# EAGLE design hiiri627v07 (EAGLE 7.5.0)
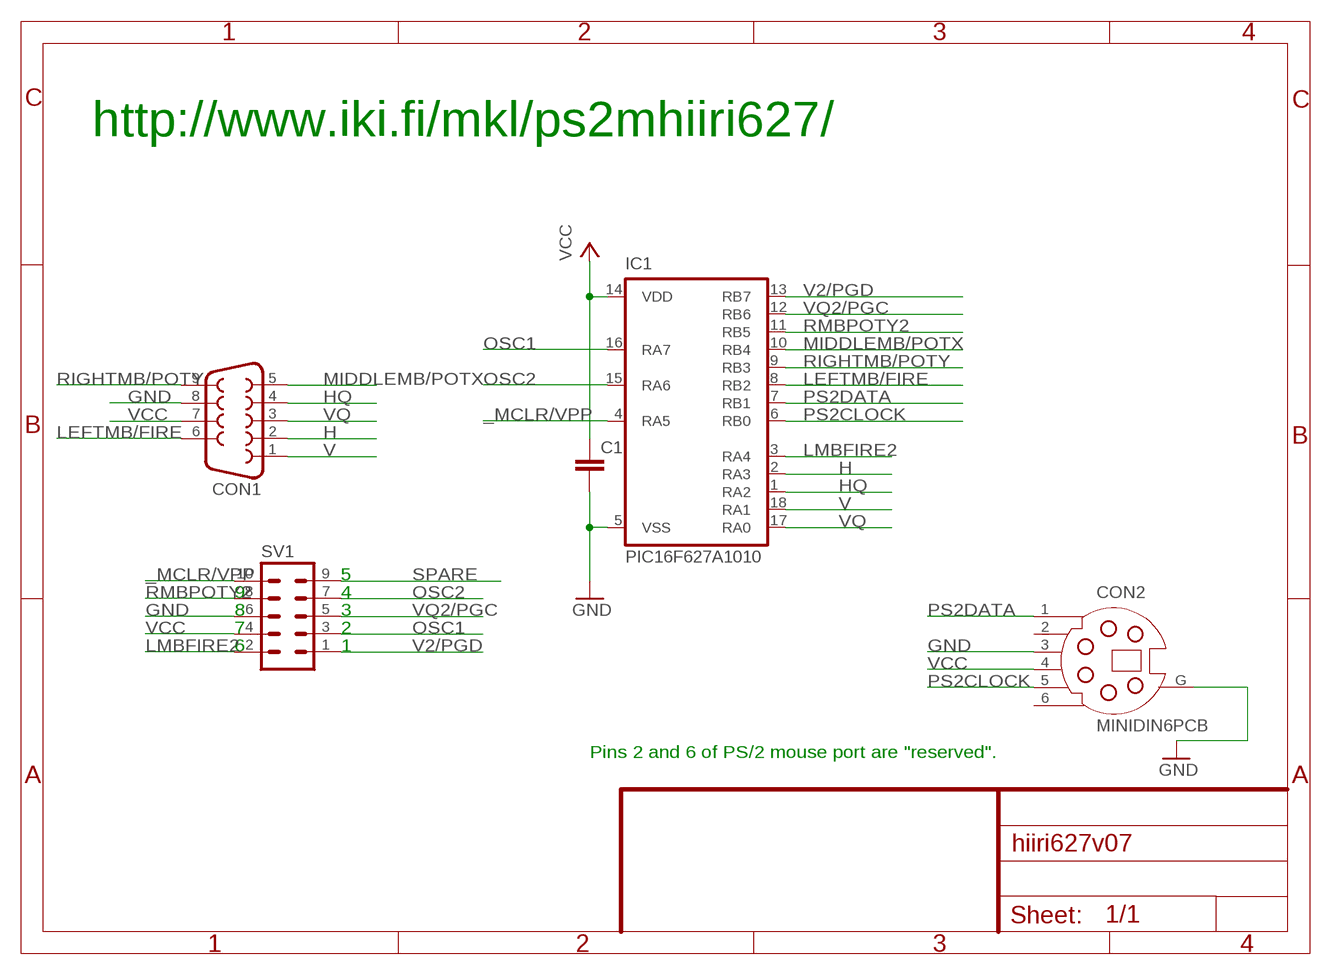
[diagram p0: schematic, sheet 1]

## Parts
C1  C-EUC0805K  [C0805K]
CON1  F09D  [F09D]
CON2  MINIDIN6PCB  [MINIDIN6PCB]
IC1  PIC16F627A1010  [SO18-10101020]
SV1  ML10  [ML10]

## Nets
_MCLR/VPP: IC1.4(RA5) SV1.10
GND: C1.2 CON1.8 CON2.3 CON2.G IC1.5(VSS) SV1.6
H: CON1.2 IC1.2(RA3)
HQ: CON1.4 IC1.1(RA2)
LEFTMB/FIRE: CON1.6 IC1.8(RB2)
LMBFIRE2: IC1.3(RA4) SV1.2
MIDDLEMB/POTX: CON1.5 IC1.10(RB4)
OSC1: IC1.16(RA7) SV1.3
OSC2: IC1.15(RA6) SV1.7
PS2CLOCK: CON2.5 IC1.6(RB0)
PS2DATA: CON2.1 IC1.7(RB1)
RIGHTMB/POTY: CON1.9 IC1.9(RB3)
RMBPOTY2: IC1.11(RB5) SV1.8
SPARE: SV1.9
V: CON1.1 IC1.18(RA1)
V2/PGD: IC1.13(RB7) SV1.1
VCC: C1.1 CON1.7 CON2.4 IC1.14(VDD) SV1.4
VQ: CON1.3 IC1.17(RA0)
VQ2/PGC: IC1.12(RB6) SV1.5
Unconnected: CON2.2 CON2.6

## Notes on the sheet
- http://www.iki.fi/mkl/ps2mhiiri627/
- 5
- 9 | 4
- 8 | 3
- 7 | 2
- 6 | 1
- Pins 2 and 6 of PS/2 mouse port are "reserved".

## Library data of the parts
C1 = rcl:C-EU: CAPACITOR, European symbol
CON1 = con-subd:F09: SUB-D
CON2 = 0mikacon:MINIDIN6PCB
IC1 = 0mikalib:PIC16F627A
SV1 = con-harting-ml:ML10: HARTING

## Board
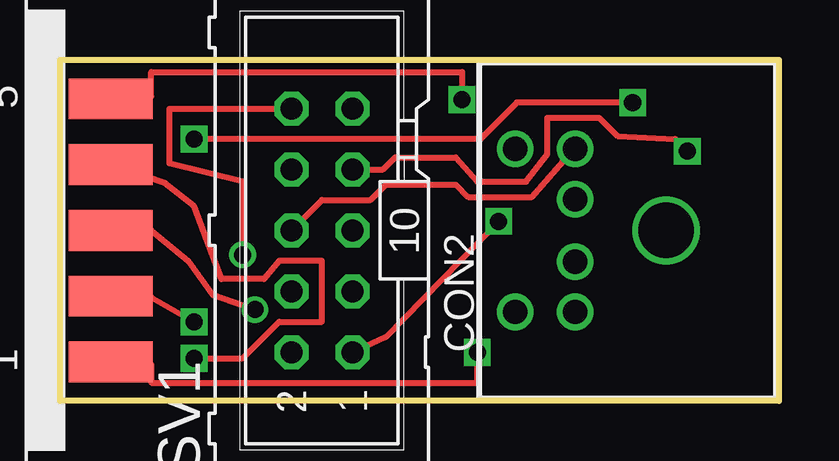
[diagram p1: board, top side]
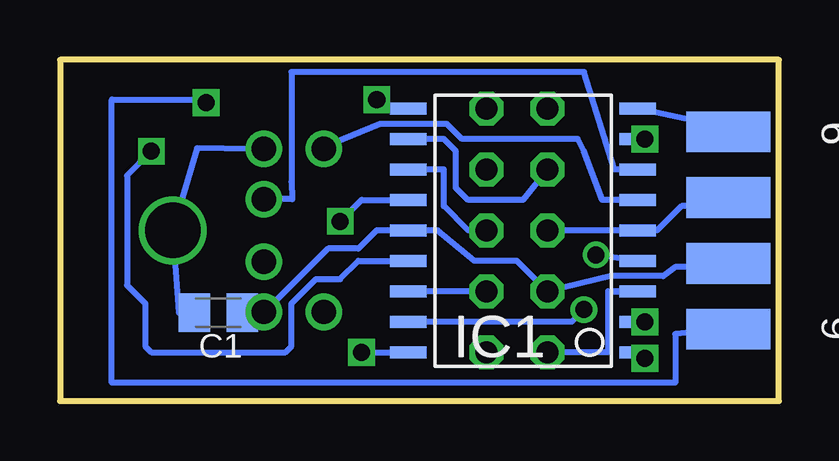
[diagram p2: board, bottom side, seen from below]

Size 29.97 x 14.22 mm. Coordinates in mm from the lower left corner, seen from the top.
Outline: 0,0 0,14.22 29.97,14.22 29.97,0 0,0
Copper layers (1*16): Top 0.035mm / dielectric 1.5mm / Bottom 0.035mm
Design rules "hiiri627": minimum track width 10mil, minimum drill 28mil, track to track 10mil, track to pad 10mil, pad to pad 10mil, via to via 10mil, smd to smd 0mil, copper to edge 10mil, drill to drill 10mil, minimum pad ring 10mil, minimum via ring 8mil, stop-mask expansion 0mil, vias tented up to drill 0mil, thermal gap 10mil

### Footprints (pad centres in the part's own frame; a part is rotated, then mirrored left to right if it is on the bottom)
C0805K = smd 1.3 x 1.6: 1 -1,0; 2 1,0
F09D = smd 1.7 x 3.5: 1 -5.486,-6.045; 2 -2.743,-6.045; 3 0,-6.045; 4 2.743,-6.045; 5 5.486,-6.045 | smd 1.7 x 3.5 bottom: 6 -4.115,-6.045; 7 -1.372,-6.045; 8 1.372,-6.045; 9 4.115,-6.045
MINIDIN6PCB = drill 1.016: 1 1.3,2.15; 2 -1.3,2.15; 3 3.4,2.15; 4 -3.4,2.15; 5 3.4,4.65; 6 -3.4,4.65 | drill 2.311: G 0,-1.65
SO18-10101020 = smd 0.508 x 1.524: 1 -5.08,-4.788; 2 -3.81,-4.788; 3 -2.54,-4.788; 4 -1.27,-4.788; 5 0,-4.788; 6 1.27,-4.788; 7 2.54,-4.788; 8 3.81,-4.788; 9 5.08,-4.788; 10 5.08,4.788; 11 3.81,4.788; 12 2.54,4.788; 13 1.27,4.788; 14 0,4.788; 15 -1.27,4.788; 16 -2.54,4.788; 17 -3.81,4.788; 18 -5.08,4.788
ML10 = drill 0.914 octagon: 1 -5.08,-1.27; 2 -5.08,1.27; 3 -2.54,-1.27; 4 -2.54,1.27; 5 0,-1.27; 6 0,1.27; 7 2.54,-1.27; 8 2.54,1.27; 9 5.08,-1.27; 10 5.08,1.27

### Placement (x,y rotation side)
C1  23.37,3.68 180 bottom
CON1  -3.94,7.11 90 top
CON2  23.62,7.11 90 top
IC1  10.67,7.11 90 bottom
SV1  10.92,7.11 90 top

### Tracks (layer width: path | path; a pad name or v marks a point on that pad's centre or on a via)
_MCLR/VPP  (via drill 0.71)
  Top 0.254: v7.62,6.1 7.62,9.14 4.57,9.91 4.57,12.19 SV1.10
  Bottom 0.254: IC1.4 v7.62,6.1
GND
  Top 0.254: SV1.6 10.92,8.38 12.95,8.38 13.59,9.02 16.51,9.02 17.02,8.51 19.68,8.51 21.43,10.51 CON2.3
  Bottom 0.254: SV1.6 IC1.5 5.08,7.11 4.06,8.13 3.81,8.13 3.56,8.38 2.54,8.38 2.44,8.48 CON1.8 | CON2.3 22,10.51 24.26,10.54 CON2.G 25.02,3.68 24.26,3.68 | 24.26,3.68 24.13,3.56 | 24.26,3.68 C1.2
H  (via drill 0.71)
  Top 0.254: v5.59,3.3 3.81,4.32 2.54,4.32 2.49,4.37 CON1.2
  Bottom 0.254: v5.59,3.3 IC1.2 v5.59,3.3
HQ  (via drill 0.71)
  Top 0.254: CON1.4 4.37,9.09 5.59,8.13 6.73,5.08 8.51,5.08 9.14,5.84 10.92,5.84 10.92,3.3 9.14,3.3 7.62,1.78 v5.59,1.78
  Bottom 0.254: IC1.1 v5.59,1.78
LEFTMB/FIRE  (via drill 0.71)
  Top 0.254: 6.1,10.92 v5.59,10.92 17.53,10.92 19.05,12.45 v23.88,12.45
  Bottom 0.254: 6.1,10.92 IC1.8 v5.59,10.92 | CON1.6 4.32,2.79 4.32,0.76 27.81,0.76 27.81,12.57 24,12.57 v23.88,12.45
LMBFIRE2
  Bottom 0.254: 6.1,4.57 6.86,4.57 | 6.1,4.57 7.11,4.57 7.11,2.03 SV1.2 | 5.84,4.57 IC1.3 6.1,4.57
MIDDLEMB/POTX  (via drill 0.71)
  Top 0.254: CON1.5 3.81,12.7 3.81,13.72 16.76,13.72 v16.76,12.57
  Bottom 0.254: IC1.10 16.76,12.19 v16.76,12.57
OSC1
  Bottom 0.254: SV1.3 IC1.16
OSC2  (via drill 0.71)
  Top 0.254: SV1.7 13.46,9.65 13.97,10.16 16.51,10.16 17.4,9.14 19.43,9.14 20.32,10.29 20.32,11.81 22.48,11.81 23.24,11.05 25.65,10.92 v26.16,10.41
  Bottom 0.254: IC1.15 17.53,5.84 18.29,5.08 19.3,5.08 20.32,4.06 20.32,2.29 20.57,2.03 26.16,2.03 26.42,2.29 26.42,4.06 27.18,4.83 27.18,9.4 v26.16,10.41
PS2CLOCK
  Bottom 0.254: IC1.6 7.37,8.38 8.13,10.41 8.38,10.92 13.21,10.92 13.84,11.56 16.64,11.56 18.97,10.59 CON2.5
PS2DATA
  Bottom 0.254: CON2.1 20.29,8.41 20.32,9.14 20.32,13.72 8.13,13.72 6.86,9.65 IC1.7
RIGHTMB/POTY
  Bottom 0.254: CON1.9 2.29,11.43 IC1.9
RMBPOTY2
  Bottom 0.254: IC1.11 13.97,10.92 13.46,10.41 13.46,8.89 12.95,8.38 10.67,8.38 SV1.8
V  (via drill 0.71)
  Top 0.254: CON1.1 3.81,1.52 3.81,0.76 17.4,0.76 v17.4,2.03
  Bottom 0.254: v17.4,2.03 IC1.18
V2/PGD  (via drill 0.71)
  Top 0.254: SV1.1 13.59,2.67 v18.29,7.49
  Bottom 0.254: IC1.13 17.4,8.38 v18.29,7.49
VCC
  Bottom 0.254: CON1.7 2.11,5.66 2.03,5.59 4.32,5.59 4.83,5.21 6.98,5.21 SV1.4 10.92,5.84 12.7,5.84 14.22,7.11 IC1.14 16.76,7.11 17.53,6.35 18.8,6.35 21.43,3.71 CON2.4 22.32,3.71 22.35,3.68 C1.1
VQ  (via drill 0.71)
  Top 0.254: CON1.3 3.81,7.11 5.33,5.84 6.35,4.45 v8.13,3.81
  Bottom 0.254: v8.13,3.81 8.64,3.3 IC1.17
VQ2/PGC
  Bottom 0.254: 15.49,9.65 IC1.12 13.97,9.65 13.97,8.13 12.95,7.11 SV1.5

### Text on the board
tDocu: V0.7